# EAGLE design Davi_APDS9960 (EAGLE 9.6.2)
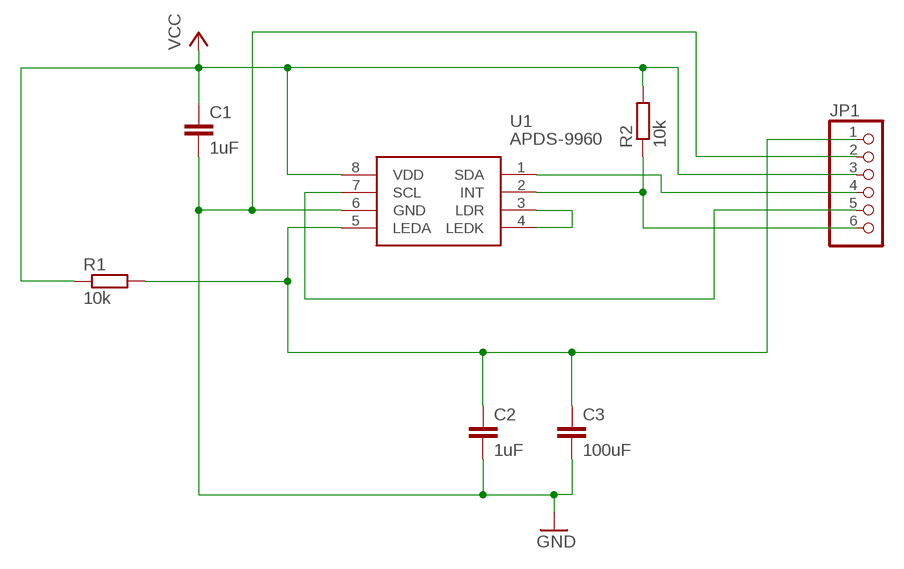
[diagram p0: schematic, sheet 1]

## Parts
C1  1uF  C-EU025-025X050  [C025-025X050]
C2  1uF  C-EU025-025X050  [C025-025X050]
C3  100uF  C-EU025-025X050  [C025-025X050]
JP1  PINHD-1X6  [1X06]
R1  10k  R-EU_0207/7  [0207/7]
R2  10k  R-EU_0207/7  [0207/7]
U1  APDS-9960  [APDS-9950]

## Nets
GND: C1.2 C2.2 C3.2 JP1.2 U1.6(GND)
N$1: U1.3(LDR) U1.4(LEDK)
N$2: C2.1 C3.1 JP1.1 R1.2 U1.5(LEDA)
N$4: JP1.6 R2.1 U1.2(INT)
N$7: JP1.4 U1.1(SDA)
N$8: JP1.5 U1.7(SCL)
VCC: C1.1 JP1.3 R1.1 R2.2 U1.8(VDD)

## Library data of the parts
C1-C3 = rcl:C-EU: CAPACITOR, European symbol; SPICEPREFIX: C
JP1 = pinhead:PINHD-1X6: PIN HEADER
R1 R2 = rcl:R-EU_: RESISTOR, European symbol; SPICEPREFIX: R
U1 = APDS-9960:APDS-9960: BROADCOM LIMITED - APDS-9960 - SENSOR, PROXIMITY/GESTURE, 2.4V TO 3.6V Source: Datasheet <https://docs.broadcom.com/docs/AV02-4191EN>; ARROW_PART_NUMBER: APDS-9960; ARROW_PRICE-STOCK: https://www.arrow.com/en/products/apds-9960/broadcom-limited?region=nac; DESCRIPTION: BROADCOM LIMITED - APDS-9960 - SENSOR, PROXIMITY/GESTURE, 2.4V TO 3.6V; HEIGHT: mm; MANUFACTURER_NAME: Avago Technologies; MANUFACTURER_PART_NUMBER: APDS-9960; MOUSER_PART_NUMBER: 630-APDS-9960; MOUSER_PRICE-STOCK: https://www.mouser.co.uk/ProductDetail/Broadcom-Avago/APDS-9960?qs=9j6qqDjiC68hPiaH59tKpQ%3D%3D

## Board
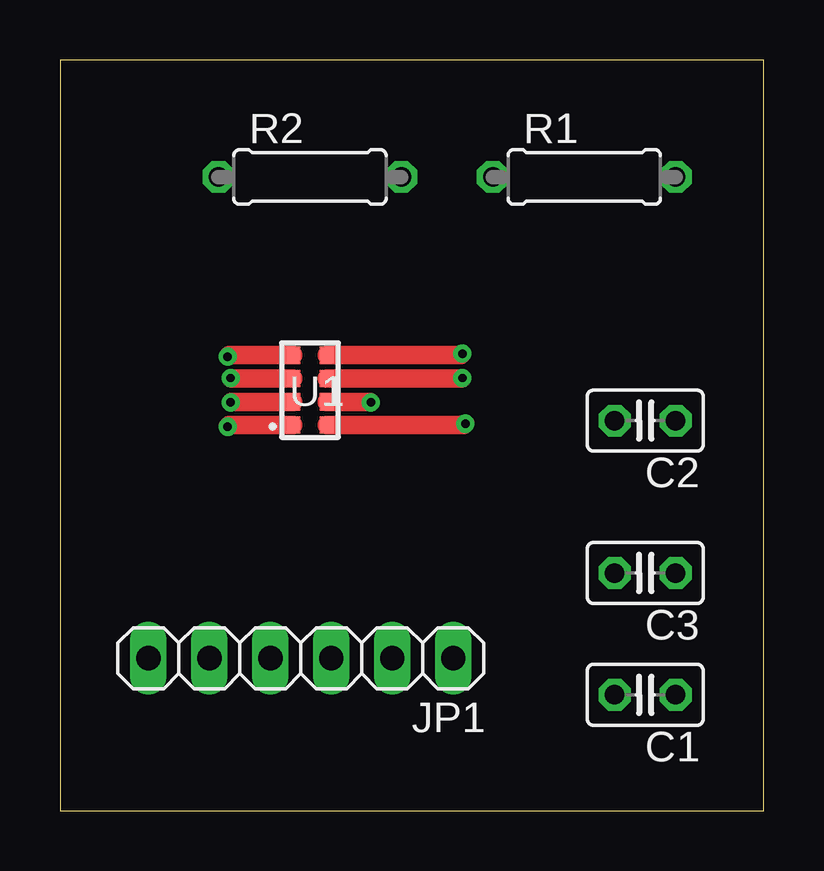
[diagram p1: board, top side]
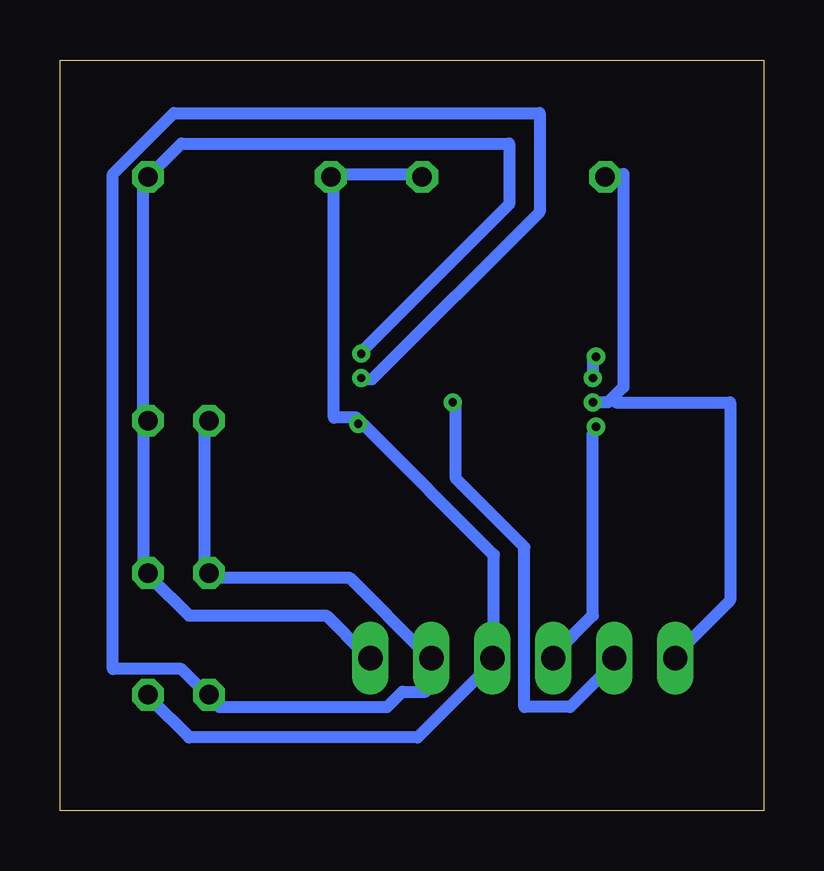
[diagram p2: board, bottom side, seen from below]

Size 29.32 x 31.29 mm. Coordinates in mm from the lower left corner, seen from the top.
Outline: 0,0 29.32,0 29.32,31.29 0,31.29 0,0
Copper layers (1*16): Top 0.035mm / dielectric 1.5mm / Bottom 0.035mm
Design rules "default *": minimum track width 20mil, minimum drill 0.35mm, track to track 20mil, track to pad 6mil, pad to pad 6mil, via to via 6mil, smd to smd 6mil, copper to edge 40mil, drill to drill 6mil, minimum pad ring 10mil, minimum via ring 8mil, stop-mask expansion 4mil, vias tented up to drill 0mil, thermal gap 10mil

### Footprints (pad centres in the part's own frame; a part is rotated, then mirrored left to right if it is on the bottom)
C025-025X050 = drill 0.813 octagon: 1 -1.27,0; 2 1.27,0
1X06 = drill 1.016 long: 1 -6.35,0; 2 -3.81,0; 3 -1.27,0; 4 1.27,0; 5 3.81,0; 6 6.35,0
0207/7 = drill 0.813 octagon: 1 -3.81,0; 2 3.81,0
APDS-9950 = smd 0.6 x 0.72: 1 0.7,1.455; 2 0.7,0.485; 3 0.7,-0.485; 4 0.7,-1.455; 5 -0.7,-1.455; 6 -0.7,-0.485; 7 -0.7,0.485; 8 -0.7,1.455

### Placement (x,y rotation side)
C1  24.38,4.83 180 top
C2  24.38,16.26 180 top
C3  24.38,9.91 180 top
JP1  10.03,6.35 180 top
R1  21.84,26.42 0 top
R2  10.41,26.42 0 top
U1  10.41,17.53 180 top

### Tracks (layer width: path | path; a pad name or v marks a point on that pad's centre or on a via)
GND  (via drill 0.35)
  Top 0.762: U1.6 16.74,18.01 v16.76,18.03
  Bottom 0.508: C2.2 23.31,16.07 23.31,10.03 C3.2 22.99,9.72 17.27,9.72 14.1,6.54 JP1.2 14.1,6.22 14.1,4.95 15.05,4.95 15.69,4.32 22.67,4.32 22.99,4.64 C1.2 23.31,4.95 24.26,5.91 27.12,5.91 27.12,26.54 24.57,29.08 9.34,29.08 9.34,24.96 16.32,17.97 16.64,17.97 v16.76,18.03
N$1  (via drill 0.35)
  Top 0.762: U1.3 7.14,18.01 v7.11,18.03 | U1.4 7.04,18.98 v6.99,18.92
  Bottom 0.508: v7.11,18.03 7.11,18.92 v6.99,18.92
N$2  (via drill 0.35)
  Top 0.762: U1.5 16.69,18.98 v16.76,19.05
  Bottom 0.508: v16.76,19.05 16.64,19.24 10.6,25.27 10.6,27.81 24.26,27.81 R1.2 25.84,26.23 25.84,16.38 C2.1 25.84,16.07 25.84,10.03 C3.1 25.53,9.72 23.94,8.13 18.22,8.13 16.64,6.54 JP1.1
N$4  (via drill 0.35)
  Top 0.762: U1.2 7.14,17.04 v7.11,17.02
  Bottom 0.508: v7.11,17.02 6.48,17.02 6.32,17.18 | 6.32,17.18 5.84,17.65 5.84,26.54 6.48,26.54 R2.1 | JP1.6 3.62,6.54 1.4,8.76 1.4,17.02 6.16,17.02 6.32,17.18
N$7  (via drill 0.35)
  Top 0.762: U1.1 7.05,16.07 v6.99,16
  Bottom 0.508: v6.99,16 7.11,15.75 7.11,8.13 8.7,6.54 JP1.4
N$8  (via drill 0.35)
  Top 0.762: U1.7 12.93,17.04 v12.95,17.02
  Bottom 0.508: v12.95,17.02 12.83,17.02 12.83,13.84 9.97,10.98 9.97,4.32 8.06,4.32 6.16,6.22 JP1.5
VCC  (via drill 0.35)
  Top 0.762: U1.8 16.83,16.07 v16.89,16.13
  Bottom 0.508: R2.2 14.41,26.54 17.91,26.54 R1.1 17.91,26.23 17.91,16.38 16.95,16.38 v16.89,16.13 16.64,16.07 11.24,10.67 11.24,6.54 JP1.3 11.24,6.22 14.41,3.05 23.94,3.05 25.53,4.64 C1.1